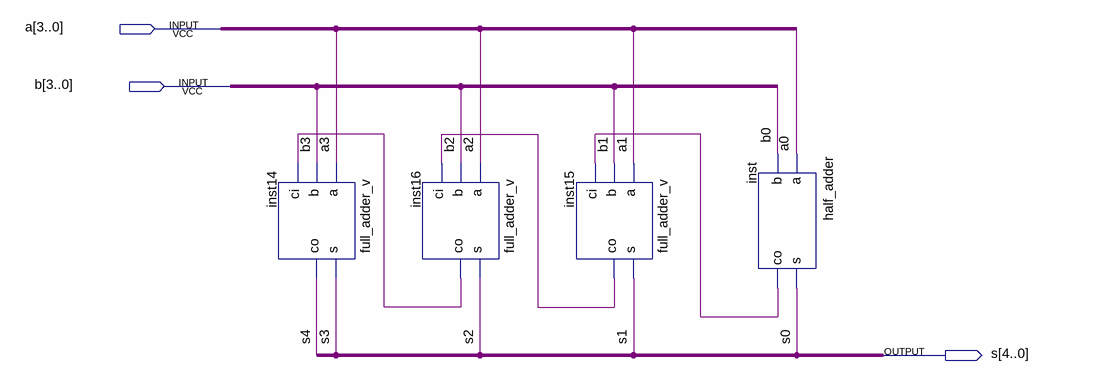
[diagram p0: schematic sheet]
// Quartus schematic 4bit_adder.bdf as structural Verilog: 4 symbols, 3 pins
module \4bit_adder  (
  input  [3:0] a,
  input  [3:0] b,
  output [4:0] s
);

  wire inst15_co, inst16_co, inst_co;

  full_adder_v inst14 (.a(a[3]), .b(b[3]), .ci(inst16_co), .s(s[3]), .co(s[4]));
  full_adder_v inst16 (.a(a[2]), .b(b[2]), .ci(inst15_co), .s(s[2]), .co(inst16_co));
  full_adder_v inst15 (.a(a[1]), .b(b[1]), .ci(inst_co), .s(s[1]), .co(inst15_co));
  half_adder inst (.a(a[0]), .b(b[0]), .s(s[0]), .co(inst_co));
endmodule
